# Altium project Leak Sensor.PrjPcb
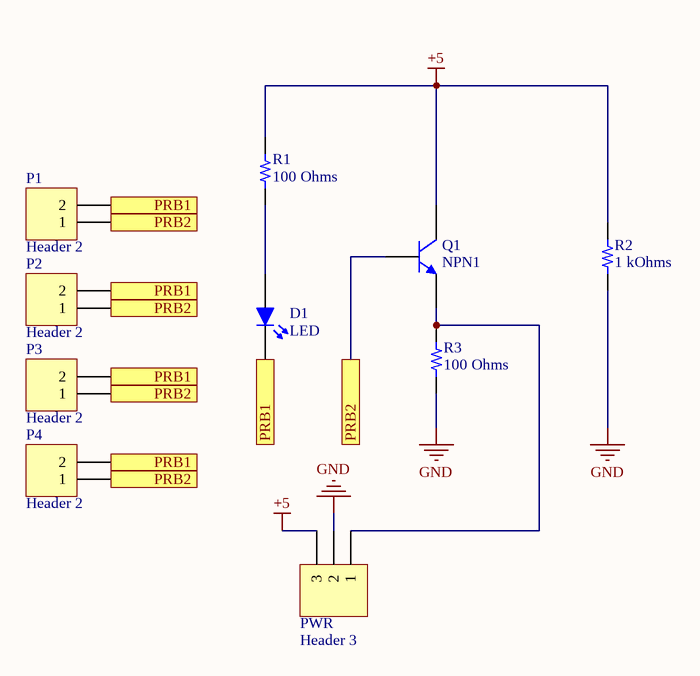
[diagram p0: Leak Sensor Schematic.SchDoc]
1 sheet, 10 parts. Net scope: flat (ports and power ports of the same name join across sheets).
Board file: Leak Sensor PCB.PcbDoc

## Sheet Leak Sensor Schematic.SchDoc
size A4; SheetNumber: 1; SheetTotal: 1

### Parts
D1  LED  [5mm THT LED]
P1  Header 2  [HDR1X2]
P2  Header 2  [HDR1X2]
P3  Header 2  [HDR1X2]
P4  Header 2  [HDR1X2]
PWR  Header 3  [HDR1X3]
Q1  NPN1  [TO-92]
R1  100 Ohms  [RES 1210_3225]
R2  1 kOhms  [RES 1210_3225]
R3  100 Ohms  [RES 1210_3225]

### Ports
PRB1, PRB2

### Nets
+5: PWR.3 Q1.1(C) R1.2 R2.2
GND: PWR.2 R2.1 R3.1
NetD1_1: D1.1 R1.1
NetD1_2: D1.2 P1.2 P2.2 P3.2 P4.2 ; port PRB1
NetP1_1: P1.1 P2.1 P3.1 P4.1 Q1.2(B) ; port PRB2
NetPWR_1: PWR.1 Q1.3(E) R3.2

### Library data of the parts
D1 = 5mm THT LED
P1-P4 = Header 2: Header, 2-Pin; LatestRevisionDate: 17-Jul-2002; LatestRevisionNote: Re-released for DXP Platform.; Publisher: Altium Limited
PWR = Header 3: Header, 3-Pin; LatestRevisionDate: 17-Jul-2002; LatestRevisionNote: Re-released for DXP Platform.; Publisher: Altium Limited
Q1 = NPN1: NPN Bipolar Transistor; Published: 8-Jun-2000; LatestRevisionDate: 17-Jul-2002; LatestRevisionNote: Re-released for DXP Platform.; DatasheetVersion: 1989; PackageVersion: 1989; PackageReference: TO-92; Publisher: Altium Limited; PackageDescription: TO, Flat Index; 3 In-Line, Axial Leads; Body Dia. 4.6mm; Leads 0.41 x 0.39 mm (max); Code_JEDEC: TO-92
R1 R3 = RMCF1210JT100R: RES 100 OHM 5% 1/2W 1210; Manufacturer: Stackpole Electronics Inc; Power (Watts): 0.5W, 1/2W; Temperature Coefficient: ±200ppm/°C; Part Number: RMCF1210JT100R; ComponentLink1Description: Datasheet; ComponentLink1URL: https://www.seielect.com/catalog/sei-rmcf_rmcp.pdf; ComponentLink2Description: DigiKey Link; ComponentLink2URL: http://digikey.com/product-detail/en/stackpole-electronics-inc/RMCF1210JT100R/RMCF1210JT100RCT-ND/1942845; Composition: Thick Film; Device Package: 1210 (3225 Metric); Features: Automotive AEC-Q200; Height - Seated (Max): 0.028" (0.70mm); LastUpdated: 2.09.2020 01:26:23; Lifecycle Status: Active; Minimum Order: 1; Number of Terminations: 2; Operating Temperature: -55°C ~ 155°C; Package / Case: 1210 (3225 Metric); Packaging: TapeAndReel; Part Status: Active; Price: 0.01; Ratings: AEC-Q200; Resistance: 100 Ohms; Series: RMCF; Size / Dimension: 0.126" L x 0.098" W (3.20mm x 2.50mm); Supplier 1: DigiKey; Supplier Part Number 1: RMCF1210JT100RCT-ND; Supplier Device Package: 1210; Tolerance: ±5%; Value: 100 Ohms
R2 = RMCF1210JT1K00: RES 1K OHM 5% 1/3W 1210; Manufacturer: Stackpole Electronics Inc; Power (Watts): 0.333W, 1/3W; Temperature Coefficient: ±200ppm/°C; Part Number: RMCF1210JT1K00; ComponentLink1Description: Datasheet; ComponentLink1URL: https://www.seielect.com/catalog/sei-rmcf_rmcp.pdf; ComponentLink2Description: DigiKey Link; ComponentLink2URL: http://digikey.com/product-detail/en/stackpole-electronics-inc/RMCF1210JT1K00/RMCF1210JT1K00CT-ND/1942858; Composition: Thick Film; Device Package: 1210 (3225 Metric); Features: Automotive AEC-Q200; Height - Seated (Max): 0.028" (0.70mm); LastUpdated: 2.09.2020 01:26:23; Lifecycle Status: Active; Minimum Order: 1; Number of Terminations: 2; Operating Temperature: -55°C ~ 155°C; Package / Case: 1210 (3225 Metric); Packaging: TapeAndReel; Part Status: Active; Price: 0.01; Ratings: AEC-Q200; Resistance: 1 kOhms; Series: RMCF; Size / Dimension: 0.126" L x 0.098" W (3.20mm x 2.50mm); Supplier 1: DigiKey; Supplier Part Number 1: RMCF1210JT1K00CT-ND; Supplier Device Package: 1210; Tolerance: ±5%; Value: 1 kOhms